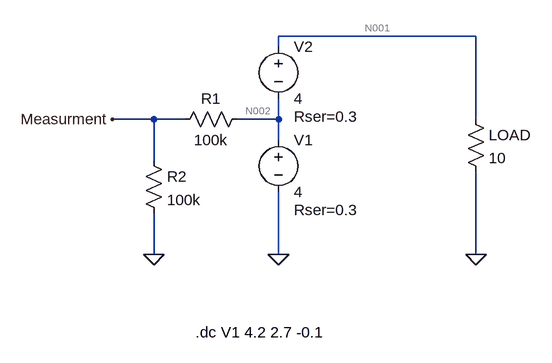
[diagram p0: schematic BatteryMonitorTestv2.asc]
BatteryMonitorTestv2.asc, the LTspice schematic file:
Version 4
SHEET 1 1208 680
WIRE 1120 16 816 16
WIRE 816 32 816 16
WIRE 624 144 560 144
WIRE 672 144 624 144
WIRE 816 144 816 112
WIRE 816 144 752 144
WIRE 1120 144 1120 16
WIRE 816 176 816 144
WIRE 624 208 624 144
WIRE 624 352 624 288
WIRE 816 352 816 256
WIRE 1120 352 1120 224
FLAG 1120 352 0
FLAG 816 352 0
FLAG 560 144 Measurment
FLAG 624 352 0
SYMBOL voltage 816 160 R0
WINDOW 123 0 0 Left 0
WINDOW 39 24 124 Left 2
SYMATTR InstName V1
SYMATTR Value 4
SYMATTR SpiceLine Rser=0.3
SYMBOL voltage 816 16 R0
WINDOW 123 0 0 Left 0
WINDOW 39 24 124 Left 2
SYMATTR InstName V2
SYMATTR Value 4
SYMATTR SpiceLine Rser=0.3
SYMBOL res 1104 128 R0
SYMATTR InstName LOAD
SYMATTR Value 10
SYMBOL res 768 128 R90
WINDOW 0 0 56 VBottom 2
WINDOW 3 32 56 VTop 2
SYMATTR InstName R1
SYMATTR Value 100k
SYMBOL res 608 192 R0
SYMATTR InstName R2
SYMATTR Value 100k
TEXT 688 472 Left 2 !.dc V1 4.2 2.7 -0.1

The netlist it stands for:
* BatteryMonitorTestv2.asc
V1 N002 0 4 Rser=0.3
V2 N001 N002 4 Rser=0.3
R§LOAD N001 0 10
R1 N002 Measurment 100k
R2 Measurment 0 100k
.dc V1 4.2 2.7 -0.1
.backanno
.end

* Results of the author's LTspice run, read from the files saved beside the schematic
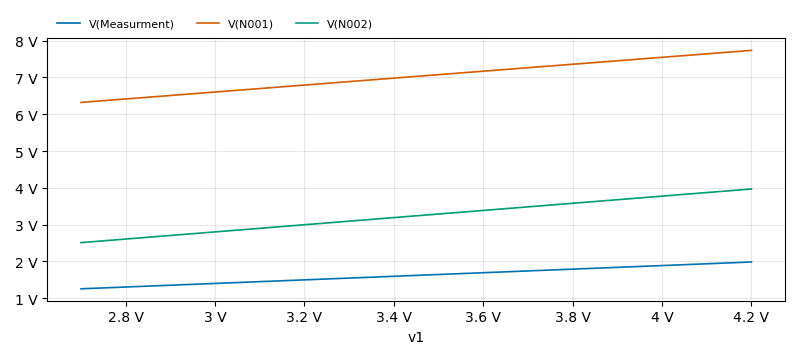
[diagram p1: DC transfer characteristic of BatteryMonitorTestv2.asc, plotted from the saved traces]
* DC transfer characteristic, 1 run:
*   V(Measurment): 1.984 V at v1=4.2 V, 1.255 V at v1=2.7 V, min 1.255 V, max 1.984 V
*   V(N001): 7.736 V at v1=4.2 V, 6.321 V at v1=2.7 V, min 6.321 V, max 7.736 V
*   V(N002): 3.968 V at v1=4.2 V, 2.51 V at v1=2.7 V, min 2.51 V, max 3.968 V